# Altium schematic sheet maga.SchDoc
size A3; PageSetup: Record=PageOptions|CenterHorizontal=True|CenterVertical=True|PrintScale=0.71|XCorrection=1.00|YCorrection=1.00|PrintKind=2|BorderSize=5000000|LeftOffset=0|BottomOffset=0|Orientation=2|PaperLength=1000|PaperWidth=1000|Scale=100|PaperSource=7|PrintQuality=-4|MediaType=1|DitherType=10|PaperKind=A4|PrintScaleMode=1
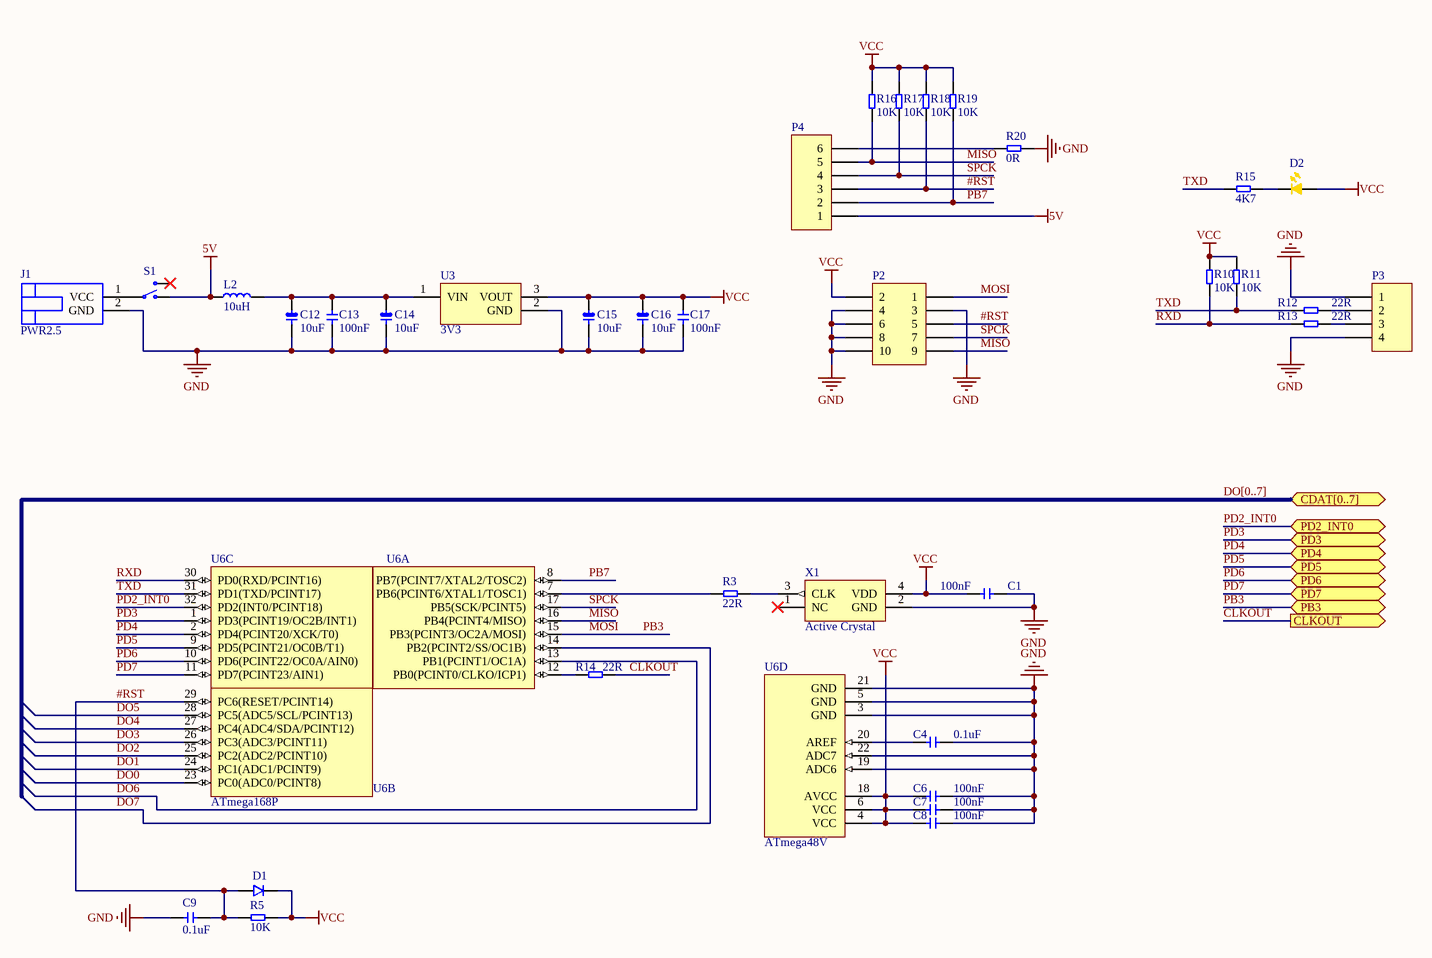
[diagram p0: maga.SchDoc]

## Parts
C1  value 100nF  [SMD_0805]  (hidden comment: Cap)
C4  value 0.1uF  [SMD_0805]  (hidden comment: Cap)
C6  value 100nF  [SMD_0805]  (hidden comment: Cap)
C7  value 100nF  [SMD_0805]  (hidden comment: Cap)
C8  value 100nF  [SMD_0805]  (hidden comment: Cap)
C9  value 0.1uF  [SMD_0805]  (hidden comment: Cap)
C12  value 10uF  [SMD_0805_POL]  (hidden comment: Cap)
C13  value 100nF  [SMD_0805]  (hidden comment: Cap)
C14  value 10uF  [SMD_0805_POL]  (hidden comment: Cap)
C15  value 10uF  [SMD_0805_POL]  (hidden comment: Cap)
C16  value 10uF  [SMD_0805_POL]  (hidden comment: Cap)
C17  value 100nF  [SMD_0805]  (hidden comment: Cap)
D1  Diode  [SOD_123]  (value not drawn)
D2  LED-YELLOW  [SMD_0805_POL]  (value not drawn)
J1  PWR2.5  [POWER_S]
L2  value 10uH  [SMD_0805]  (hidden comment: Inductor)
P2  Header 2*5  [HDR_2×5]  (value not drawn)
P3  Header 4  [HDR_1×4]  (value not drawn)
P4  Header 6  [HDR_1×6]  (value not drawn)
R3  value 22R  [SMD_0805]  (hidden comment: Res)
R5  value 10K  [SMD_0805]  (hidden comment: Res)
R10  value 10K  [SMD_0805]  (hidden comment: Res)
R11  value 10K  [SMD_0805]  (hidden comment: Res)
R12  value 22R  [SMD_0805]  (hidden comment: Res)
R13  value 22R  [SMD_0805]  (hidden comment: Res)
R14  value 22R  [SMD_0805]  (hidden comment: Res)
R15  value 4K7  [SMD_0805]  (hidden comment: Res)
R16  value 10K  [SMD_0805]  (hidden comment: Res)
R17  value 10K  [SMD_0805]  (hidden comment: Res)
R18  value 10K  [SMD_0805]  (hidden comment: Res)
R19  value 10K  [SMD_0805]  (hidden comment: Res)
R20  value 0R  [SMD_0805]  (hidden comment: Res)
S1  SW-SPDT  [SWITCH_SINGLE]  (value not drawn)
U3  3V3  [SOT_23]
U6  ATmega48V  [TQFP_32]  (value not drawn)  (parts A,B,C,D of 4)
X1  Active Crystal  [SMD_8541]

## Ports
CDAT[0..7] (bidir), CLKOUT (out), PB3 (bidir), PD2_INT0 (bidir), PD3 (bidir), PD4 (bidir), PD5 (bidir), PD6 (bidir), PD7 (bidir)

## Nets
5V: L2.1 P4.1 S1.1
GND: C1.2 C4.2 C6.2 C7.2 C8.2 C9.1 C12.2 C13.2 C14.2 C15.2 C16.2 C17.2 J1.2(GND) P2.3 P2.4 P2.6 P2.8 P2.10 P3.1 P3.4 R20.2 U3.2(GND) U6.3(GND) U6.5(GND) U6.19(ADC6) U6.21(GND) U6.22(ADC7) X1.2(GND)
VCC: C1.1 C6.1 C7.1 C8.1 C15.1 C16.1 C17.1 D1.2(K) D2.1(A) P2.2 R5.2 R10.2 R11.2 R16.2 R17.2 R18.2 R19.2 U3.3(VOUT) U6.4(VCC) U6.6(VCC) U6.18(AVCC) X1.4(VDD)
#RST: C9.2 D1.1(A) P2.5 P4.3 R5.1 R18.1 U6.29(PC6(RESET/PCINT14))
CLKOUT: R14.1 ; port CLKOUT
DO0: U6.23(PC0(ADC0/PCINT8))
DO1: U6.24(PC1(ADC1/PCINT9))
DO2: U6.25(PC2(ADC2/PCINT10))
DO3: U6.26(PC3(ADC3/PCINT11))
DO4: U6.27(PC4(ADC4/SDA/PCINT12))
DO5: U6.28(PC5(ADC5/SCL/PCINT13))
DO6: U6.13(PB1(PCINT1/OC1A))
DO7: U6.14(PB2(PCINT2/SS/OC1B))
MISO: P2.9 P4.5 R16.1 U6.16(PB4(PCINT4/MISO))
MOSI: P2.1 U6.15(PB3(PCINT3/OC2A/MOSI)) ; port PB3  [also labelled PB3]
PB7: P4.2 R19.1 U6.8(PB7(PCINT7/XTAL2/TOSC2))
PD2_INT0: U6.32(PD2(INT0/PCINT18)) ; port PD2_INT0
PD3: U6.1(PD3(PCINT19/OC2B/INT1)) ; port PD3
PD4: U6.2(PD4(PCINT20/XCK/T0)) ; port PD4
PD5: U6.9(PD5(PCINT21/OC0B/T1)) ; port PD5
PD6: U6.10(PD6(PCINT22/OC0A/AIN0)) ; port PD6
PD7: U6.11(PD7(PCINT23/AIN1)) ; port PD7
RXD: R10.1 R13.1 U6.30(PD0(RXD/PCINT16))
SPCK: P2.7 P4.4 R17.1 U6.17(PB5(SCK/PCINT5))
TXD: R11.1 R12.1 R15.1 U6.31(PD1(TXD/PCINT17))
NetC4_1: C4.1 U6.20(AREF)
NetC12_1: C12.1 C13.1 C14.1 L2.2 U3.1(VIN)
NetD2_2: D2.2(K) R15.2
NetJ1_1: J1.1(VCC) S1.2
NetP3_2: P3.2 R12.2
NetP3_3: P3.3 R13.2
NetP4_6: P4.6 R20.1
NetR3_1: R3.1 X1.3(CLK)
NetR3_2: R3.2 U6.7(PB6(PCINT6/XTAL1/TOSC1))
NetR14_2: R14.2 U6.12(PB0(PCINT0/CLKO/ICP1))

Not connected (* = marked no-connect by the designer): S1 3*; X1 1(NC)*

## Buses and harness runs
bus DO[0..7] = port CDAT[0..7]

## Library data of the parts
C1 C4 C6-C9 C13 C17 = Cap: Capacitor; Published: 8-Jun-2000; LatestRevisionDate: 17-Jul-2002; LatestRevisionNote: Re-released for DXP Platform.; PackageReference: RAD-0.3; Publisher: Altium Limited
C12 C14-C16 = Cap Pol: Polarized Capacitor (Surface Mount); Published: 8-Jun-2000; LatestRevisionDate: 17-Jul-2002; LatestRevisionNote: Re-released for DXP Platform.; PackageReference: C0805; Publisher: Altium Limited
D1 = Diode Schottky: Schottky Diode; Value: 1N5819; Published: 8-Jun-2000; LatestRevisionDate: 17-Jul-2002; LatestRevisionNote: Re-released for DXP Platform.; PackageReference: SMB; Publisher: Altium Limited; Code_JEDEC: DO-214-AA
D2 = LED-YELLOW: Typical INFRARED GaAs LED; Published: 8-Jun-2000; LatestRevisionDate: 08-Jul-2005; LatestRevisionNote: Mech Layer 1 removed.; PackageReference: LED-0; Publisher: Altium Limited
J1 = PWR2.5: Low Voltage Power Supply Connector; Published: 17-Dec-2003; DatasheetDocument: 09-May-2002; Publisher: Altium Limited; ComponentLink1Description: Manufacturer Link; ComponentLink1URL: http://domino.kycon.com/internet/Products.html
L2 = Inductor: Code_IEC: 1005; Published: 8-Jun-2000; LatestRevisionDate: 17-Jul-2002; LatestRevisionNote: Re-released for DXP Platform.; PackageReference: 0402-A; Publisher: Altium Limited; Code_JEITA: 0402
P2 = Header 2*5: Header, 10-Pin; LatestRevisionDate: 17-Jul-2002; LatestRevisionNote: Re-released for DXP Platform.; Publisher: Altium Limited; Value: Header 2
P3 = Header 4: Header, 4-Pin; LatestRevisionDate: 17-Jul-2002; LatestRevisionNote: Re-released for DXP Platform.; Publisher: Altium Limited; Value: Header 4
P4 = Header 6: Header, 6-Pin; LatestRevisionDate: 17-Jul-2002; LatestRevisionNote: Re-released for DXP Platform.; Publisher: Altium Limited; Value: Header 6
R3 R5 R10-R20 = Res: Resistor; Published: 8-Jun-2000; LatestRevisionDate: 17-Jul-2002; LatestRevisionNote: Re-released for DXP Platform.; PackageReference: AXIAL-0.3; Publisher: Altium Limited
S1 = SW-SPDT: SPDT Subminiature Toggle Switch, Right Angle Mounting, Vertical Actuation; Published: 24-Mar-1999; LatestRevisionDate: 17-Dec-2003; LatestRevisionNote: Schematic revised, PCB Footprint replaced.; DatasheetDocument: 05-Dec-2000; PackageReference: TL36WW15050; Publisher: Altium Limited; ComponentLink1Description: Manufacturer Link; ComponentLink1URL: http://www.apem.com
U3 = XC6206: LDOs
U6 = ATmega48V: 具有8K系统内可编程Flash 的AVR8 位微控制器
X1 = XTAL_ACT